# EAGLE schematic PinHeck Test Jig (EAGLE 6.6.0)
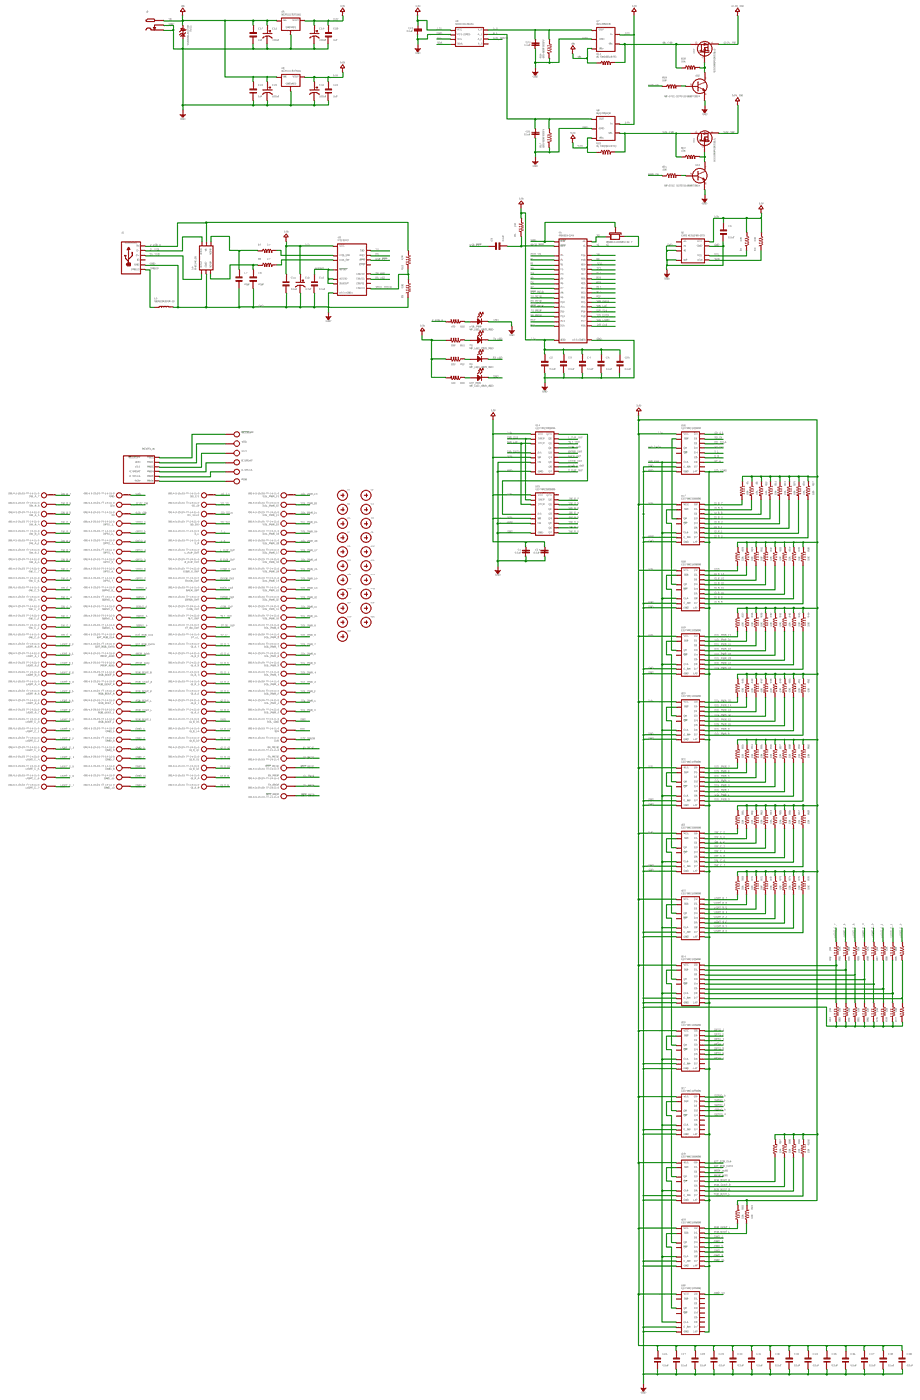
[diagram p0: schematic, sheet 1, overview]
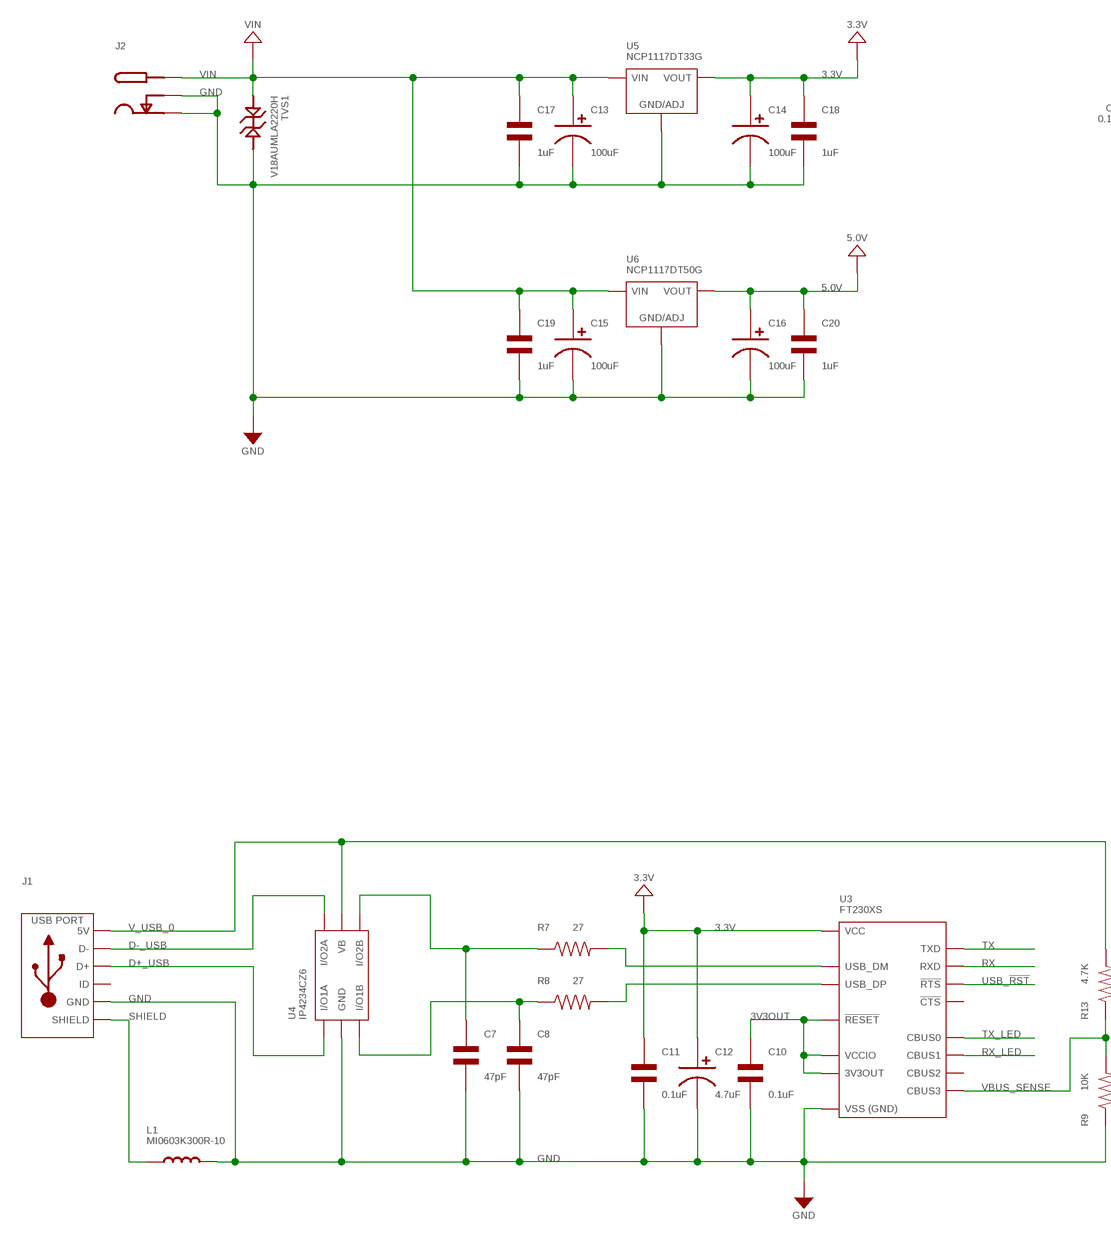
[diagram p1: schematic, sheet 1, part 1 of 7]
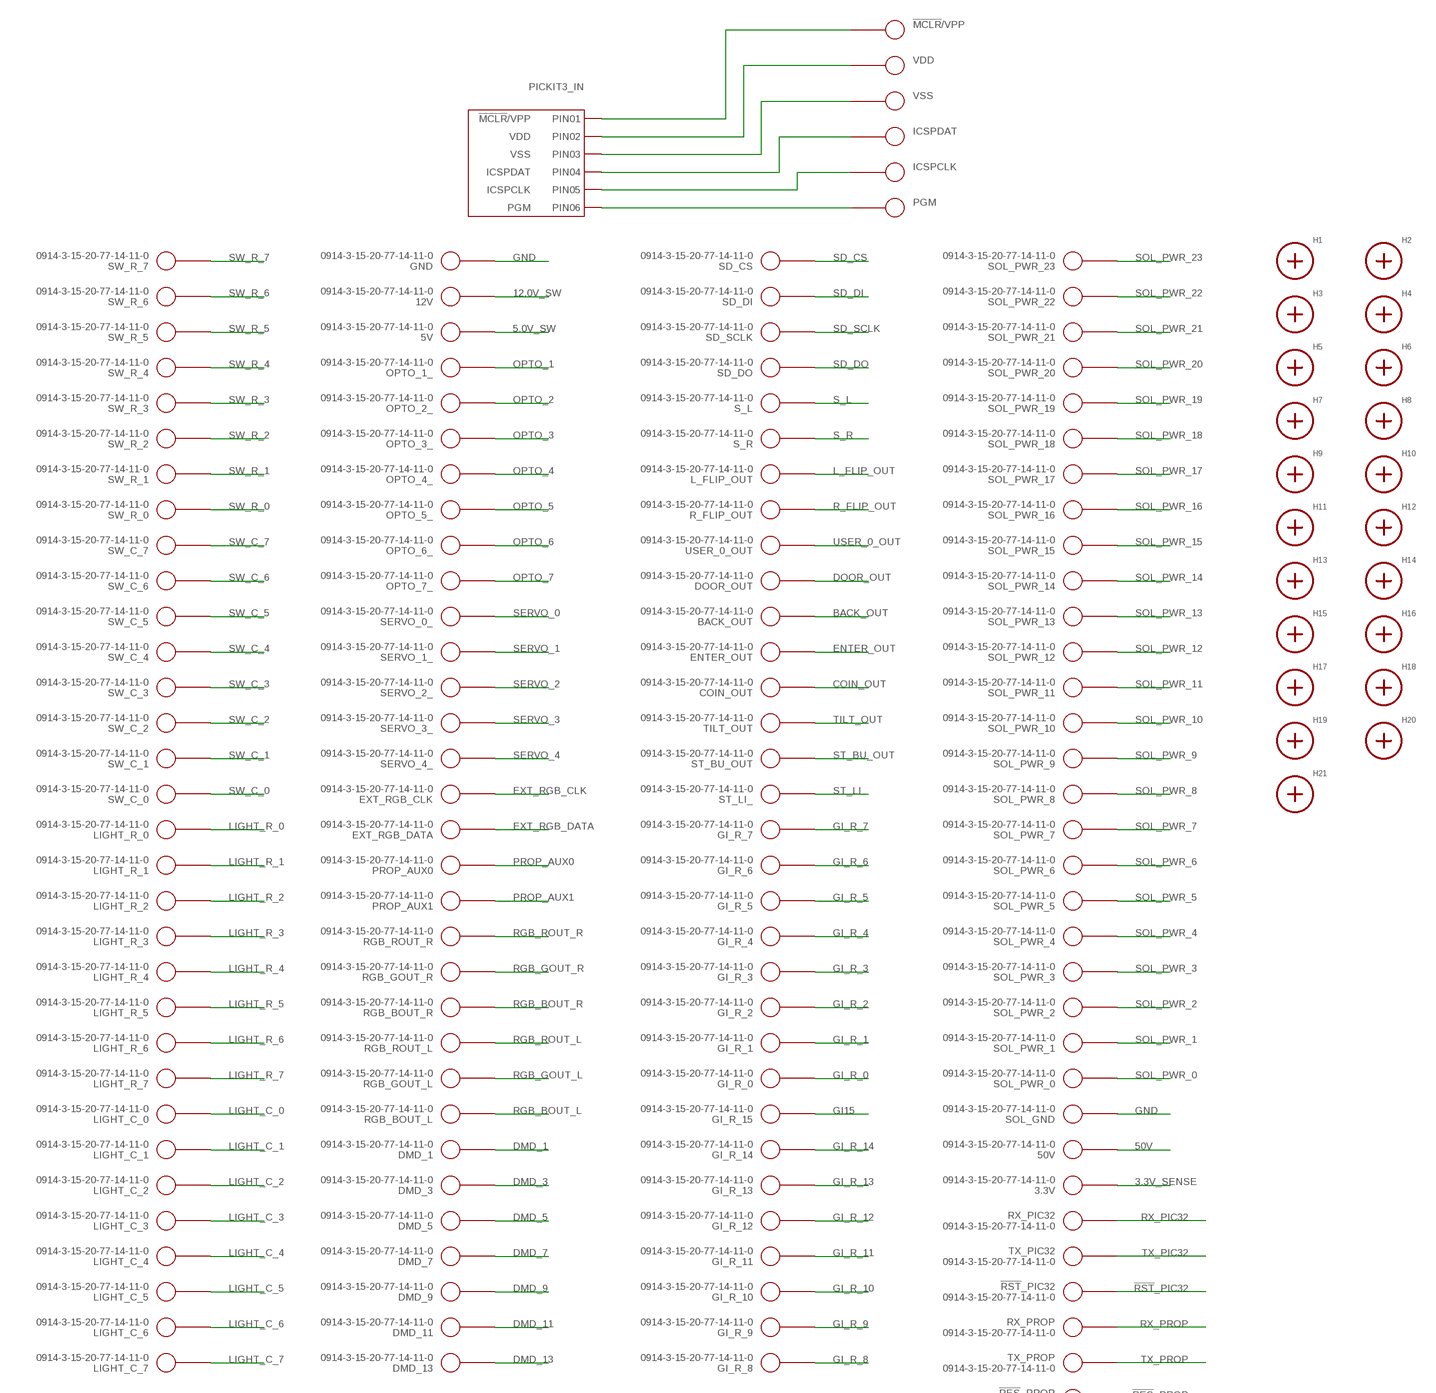
[diagram p2: schematic, sheet 1, part 2 of 7]
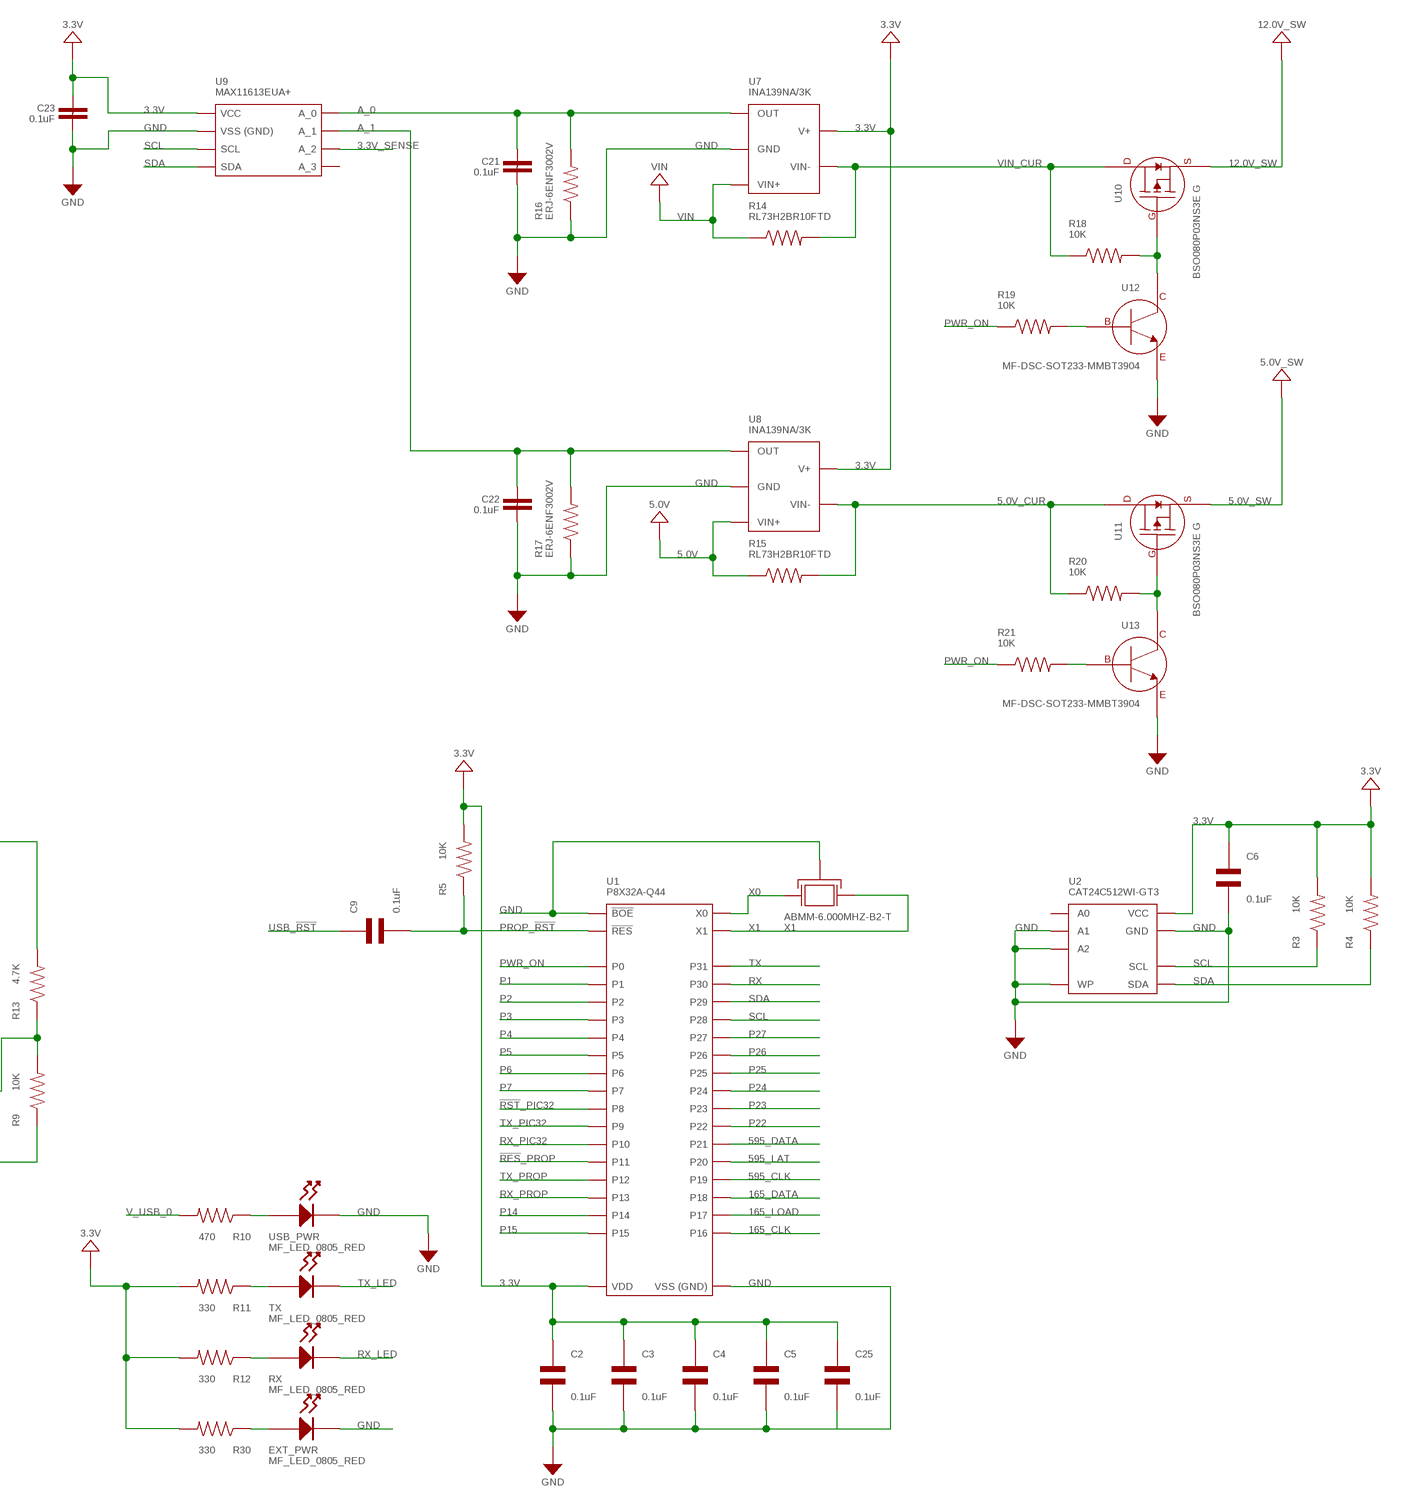
[diagram p3: schematic, sheet 1, part 3 of 7]
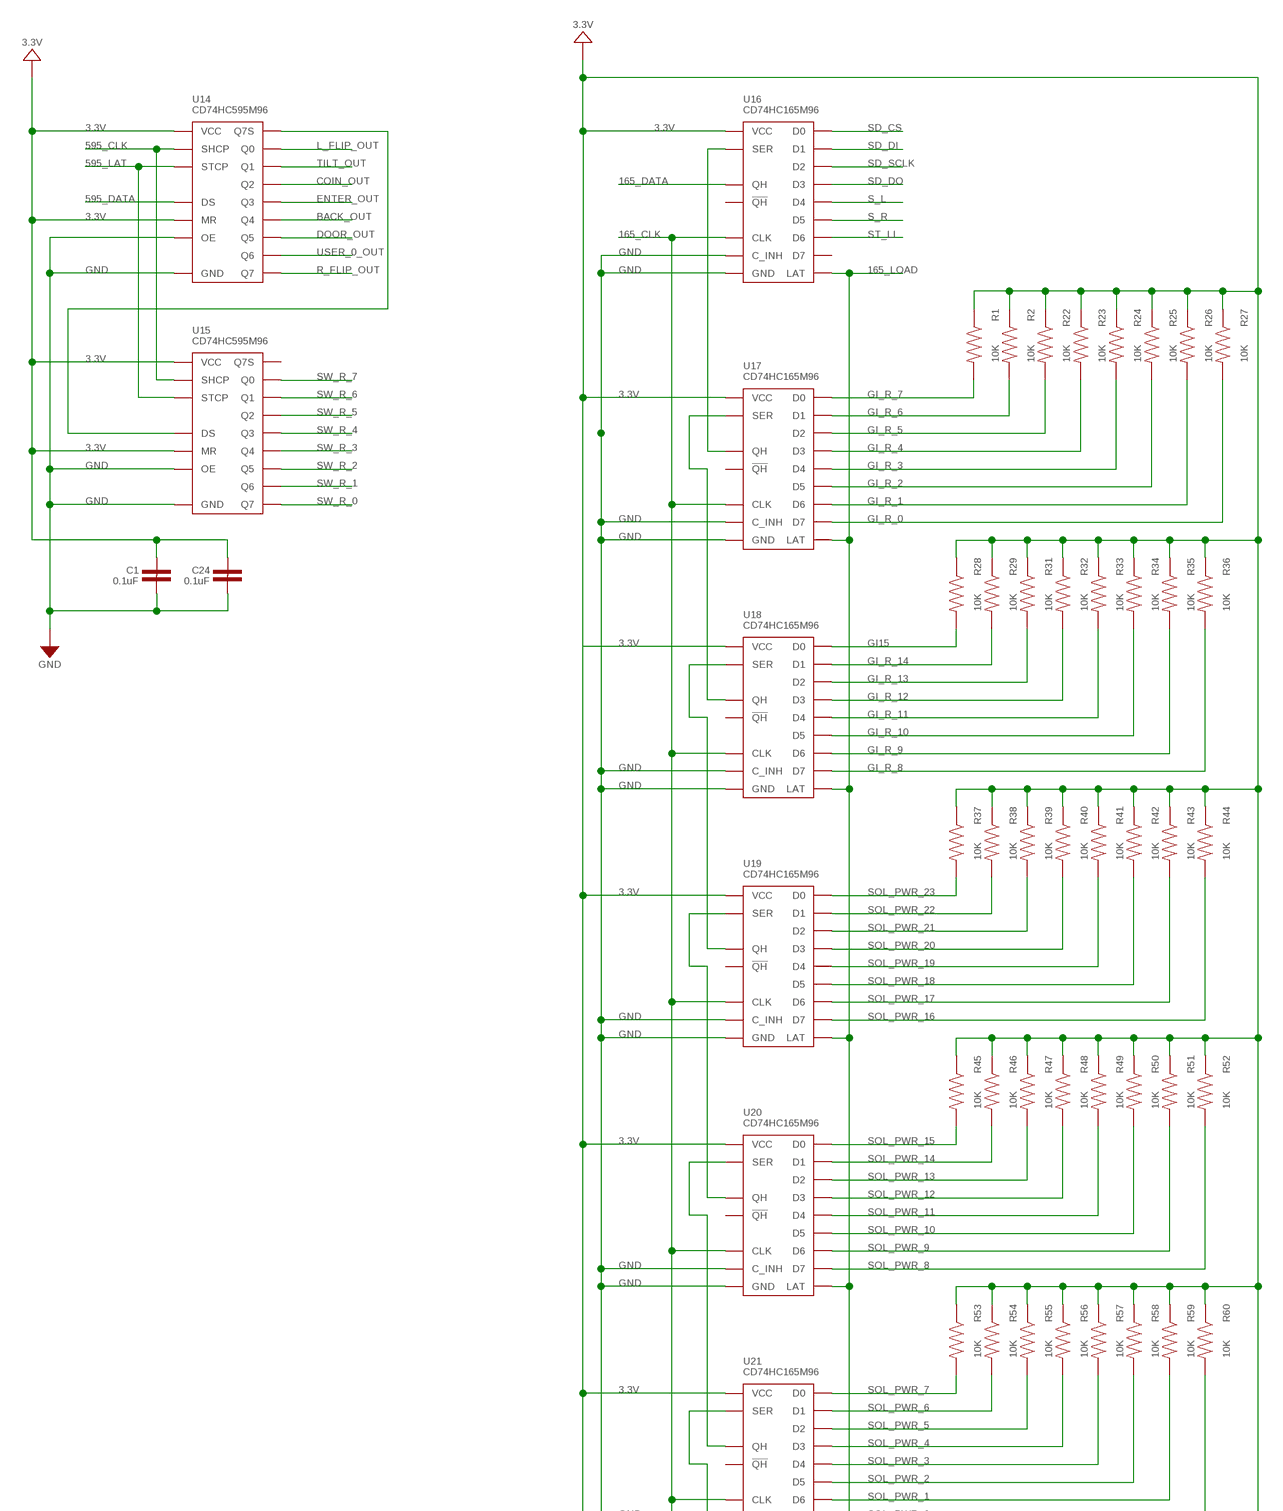
[diagram p4: schematic, sheet 1, part 4 of 7]
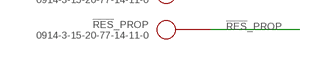
[diagram p5: schematic, sheet 1, part 5 of 7]
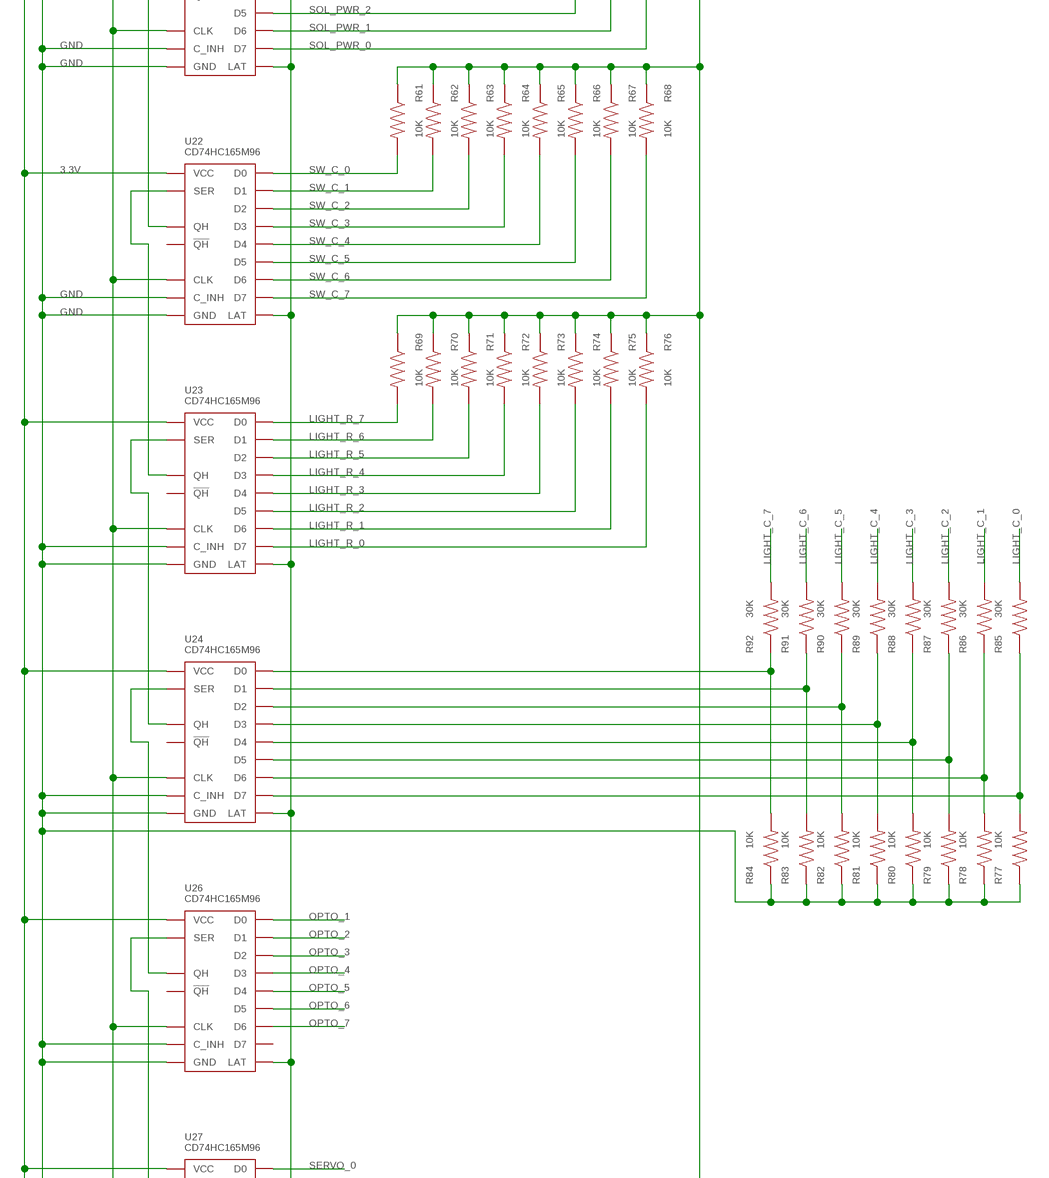
[diagram p6: schematic, sheet 1, part 6 of 7]
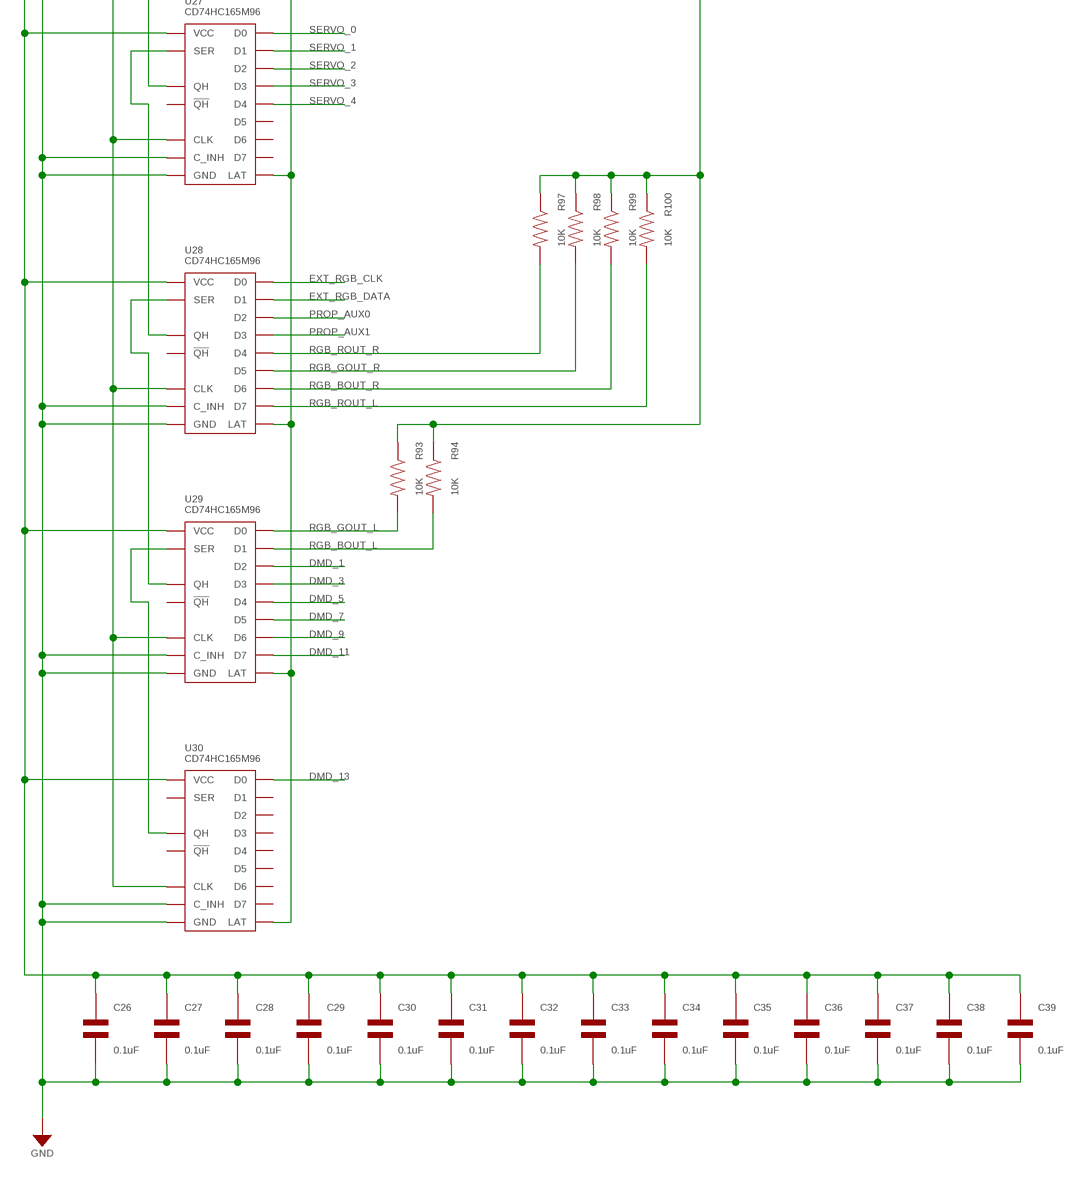
[diagram p7: schematic, sheet 1, part 7 of 7]

## Parts
3.3V  0914-3-15-20-77-14-11-0  POGO_PIN_0914-3-15-20-77-14-11-0  [0914-3-15-20-77-14-11-0]
5V  0914-3-15-20-77-14-11-0  POGO_PIN_0914-3-15-20-77-14-11-0  [0914-3-15-20-77-14-11-0]
12V  0914-3-15-20-77-14-11-0  POGO_PIN_0914-3-15-20-77-14-11-0  [0914-3-15-20-77-14-11-0]
50V  0914-3-15-20-77-14-11-0  POGO_PIN_0914-3-15-20-77-14-11-0  [0914-3-15-20-77-14-11-0]
!MCLR!/VPP  POGO_PIN_0914-3-15-20-77-14-11-0  [0914-3-15-20-77-14-11-0]
!RES!_PROP  0914-3-15-20-77-14-11-0  POGO_PIN_0914-3-15-20-77-14-11-0  [0914-3-15-20-77-14-11-0]
!RST!_PIC32  0914-3-15-20-77-14-11-0  POGO_PIN_0914-3-15-20-77-14-11-0  [0914-3-15-20-77-14-11-0]
BACK_OUT  0914-3-15-20-77-14-11-0  POGO_PIN_0914-3-15-20-77-14-11-0  [0914-3-15-20-77-14-11-0]
C1  0.1uF  CAPACITOR_NON_POLAR_0805  [0805]
C2  0.1uF  CAPACITOR_NP_0603  [C0603]
C3  0.1uF  CAPACITOR_NP_0603  [C0603]
C4  0.1uF  CAPACITOR_NP_0603  [C0603]
C5  0.1uF  CAPACITOR_NP_0603  [C0603]
C6  0.1uF  CAPACITOR_NP_0603  [C0603]
C7  47pF  CAPACITOR_NP_0603  [C0603]
C8  47pF  CAPACITOR_NP_0603  [C0603]
C9  0.1uF  CAPACITOR_NP_0603  [C0603]
C10  0.1uF  CAPACITOR_NP_0603  [C0603]
C11  0.1uF  CAPACITOR_NP_0603  [C0603]
C12  4.7uF  CAPACITOR_P_4MM  [CP4MM]
C13  100uF  CAPACITOR_P_6.3MM  [CP6.3MM]
C14  100uF  CAPACITOR_P_6.3MM  [CP6.3MM]
C15  100uF  CAPACITOR_P_6.3MM  [CP6.3MM]
C16  100uF  CAPACITOR_P_6.3MM  [CP6.3MM]
C17  1uF  CAPACITOR_NP_0805  [C0805]
C18  1uF  CAPACITOR_NP_0805  [C0805]
C19  1uF  CAPACITOR_NP_0805  [C0805]
C20  1uF  CAPACITOR_NP_0805  [C0805]
C21  0.1uF  CAPACITOR_NON_POLAR_0805  [0805]
C22  0.1uF  CAPACITOR_NON_POLAR_0805  [0805]
C23  0.1uF  CAPACITOR_NON_POLAR_0805  [0805]
C24  0.1uF  CAPACITOR_NON_POLAR_0805  [0805]
C25  0.1uF  CAPACITOR_NP_0603  [C0603]
C26  0.1uF  CAPACITOR_NP_0603  [C0603]
C27  0.1uF  CAPACITOR_NP_0603  [C0603]
C28  0.1uF  CAPACITOR_NP_0603  [C0603]
C29  0.1uF  CAPACITOR_NP_0603  [C0603]
C30  0.1uF  CAPACITOR_NP_0603  [C0603]
C31  0.1uF  CAPACITOR_NP_0603  [C0603]
C32  0.1uF  CAPACITOR_NP_0603  [C0603]
C33  0.1uF  CAPACITOR_NP_0603  [C0603]
C34  0.1uF  CAPACITOR_NP_0603  [C0603]
C35  0.1uF  CAPACITOR_NP_0603  [C0603]
C36  0.1uF  CAPACITOR_NP_0603  [C0603]
C37  0.1uF  CAPACITOR_NP_0603  [C0603]
C38  0.1uF  CAPACITOR_NP_0603  [C0603]
C39  0.1uF  CAPACITOR_NP_0603  [C0603]
COIN_OUT  0914-3-15-20-77-14-11-0  POGO_PIN_0914-3-15-20-77-14-11-0  [0914-3-15-20-77-14-11-0]
DMD_1  0914-3-15-20-77-14-11-0  POGO_PIN_0914-3-15-20-77-14-11-0  [0914-3-15-20-77-14-11-0]
DMD_3  0914-3-15-20-77-14-11-0  POGO_PIN_0914-3-15-20-77-14-11-0  [0914-3-15-20-77-14-11-0]
DMD_5  0914-3-15-20-77-14-11-0  POGO_PIN_0914-3-15-20-77-14-11-0  [0914-3-15-20-77-14-11-0]
DMD_7  0914-3-15-20-77-14-11-0  POGO_PIN_0914-3-15-20-77-14-11-0  [0914-3-15-20-77-14-11-0]
DMD_9  0914-3-15-20-77-14-11-0  POGO_PIN_0914-3-15-20-77-14-11-0  [0914-3-15-20-77-14-11-0]
DMD_11  0914-3-15-20-77-14-11-0  POGO_PIN_0914-3-15-20-77-14-11-0  [0914-3-15-20-77-14-11-0]
DMD_13  0914-3-15-20-77-14-11-0  POGO_PIN_0914-3-15-20-77-14-11-0  [0914-3-15-20-77-14-11-0]
DOOR_OUT  0914-3-15-20-77-14-11-0  POGO_PIN_0914-3-15-20-77-14-11-0  [0914-3-15-20-77-14-11-0]
ENTER_OUT  0914-3-15-20-77-14-11-0  POGO_PIN_0914-3-15-20-77-14-11-0  [0914-3-15-20-77-14-11-0]
EXT_PWR  MF_LED_0805_RED  LED_SINGLE_0805  [LED0805]
EXT_RGB_CLK  0914-3-15-20-77-14-11-0  POGO_PIN_0914-3-15-20-77-14-11-0  [0914-3-15-20-77-14-11-0]
EXT_RGB_DATA  0914-3-15-20-77-14-11-0  POGO_PIN_0914-3-15-20-77-14-11-0  [0914-3-15-20-77-14-11-0]
GI_R_0  0914-3-15-20-77-14-11-0  POGO_PIN_0914-3-15-20-77-14-11-0  [0914-3-15-20-77-14-11-0]
GI_R_1  0914-3-15-20-77-14-11-0  POGO_PIN_0914-3-15-20-77-14-11-0  [0914-3-15-20-77-14-11-0]
GI_R_2  0914-3-15-20-77-14-11-0  POGO_PIN_0914-3-15-20-77-14-11-0  [0914-3-15-20-77-14-11-0]
GI_R_3  0914-3-15-20-77-14-11-0  POGO_PIN_0914-3-15-20-77-14-11-0  [0914-3-15-20-77-14-11-0]
GI_R_4  0914-3-15-20-77-14-11-0  POGO_PIN_0914-3-15-20-77-14-11-0  [0914-3-15-20-77-14-11-0]
GI_R_5  0914-3-15-20-77-14-11-0  POGO_PIN_0914-3-15-20-77-14-11-0  [0914-3-15-20-77-14-11-0]
GI_R_6  0914-3-15-20-77-14-11-0  POGO_PIN_0914-3-15-20-77-14-11-0  [0914-3-15-20-77-14-11-0]
GI_R_7  0914-3-15-20-77-14-11-0  POGO_PIN_0914-3-15-20-77-14-11-0  [0914-3-15-20-77-14-11-0]
GI_R_8  0914-3-15-20-77-14-11-0  POGO_PIN_0914-3-15-20-77-14-11-0  [0914-3-15-20-77-14-11-0]
GI_R_9  0914-3-15-20-77-14-11-0  POGO_PIN_0914-3-15-20-77-14-11-0  [0914-3-15-20-77-14-11-0]
GI_R_10  0914-3-15-20-77-14-11-0  POGO_PIN_0914-3-15-20-77-14-11-0  [0914-3-15-20-77-14-11-0]
GI_R_11  0914-3-15-20-77-14-11-0  POGO_PIN_0914-3-15-20-77-14-11-0  [0914-3-15-20-77-14-11-0]
GI_R_12  0914-3-15-20-77-14-11-0  POGO_PIN_0914-3-15-20-77-14-11-0  [0914-3-15-20-77-14-11-0]
GI_R_13  0914-3-15-20-77-14-11-0  POGO_PIN_0914-3-15-20-77-14-11-0  [0914-3-15-20-77-14-11-0]
GI_R_14  0914-3-15-20-77-14-11-0  POGO_PIN_0914-3-15-20-77-14-11-0  [0914-3-15-20-77-14-11-0]
GI_R_15  0914-3-15-20-77-14-11-0  POGO_PIN_0914-3-15-20-77-14-11-0  [0914-3-15-20-77-14-11-0]
GND  0914-3-15-20-77-14-11-0  POGO_PIN_0914-3-15-20-77-14-11-0  [0914-3-15-20-77-14-11-0]
H1  2263-2  MOUNT_HOLE120MIL  [MOUNT_HOLE_120MIL]
H2  2263-2  MOUNT_HOLE120MIL  [MOUNT_HOLE_120MIL]
H3  2263-2  MOUNT_HOLE120MIL  [MOUNT_HOLE_120MIL]
H4  2263-2  MOUNT_HOLE120MIL  [MOUNT_HOLE_120MIL]
H5  2263-2  MOUNT_HOLE120MIL  [MOUNT_HOLE_120MIL]
H6  2263-2  MOUNT_HOLE120MIL  [MOUNT_HOLE_120MIL]
H7  2263-2  MOUNT_HOLE120MIL  [MOUNT_HOLE_120MIL]
H8  2263-2  MOUNT_HOLE120MIL  [MOUNT_HOLE_120MIL]
H9  2263-2  MOUNT_HOLE120MIL  [MOUNT_HOLE_120MIL]
H10  2263-2  MOUNT_HOLE120MIL  [MOUNT_HOLE_120MIL]
H11  2263-2  MOUNT_HOLE120MIL  [MOUNT_HOLE_120MIL]
H12  2263-2  MOUNT_HOLE120MIL  [MOUNT_HOLE_120MIL]
H13  2263-2  MOUNT_HOLE120MIL  [MOUNT_HOLE_120MIL]
H14  2263-2  MOUNT_HOLE120MIL  [MOUNT_HOLE_120MIL]
H15  2263-2  MOUNT_HOLE120MIL  [MOUNT_HOLE_120MIL]
H16  2263-2  MOUNT_HOLE120MIL  [MOUNT_HOLE_120MIL]
H17  2263-2  MOUNT_HOLE120MIL  [MOUNT_HOLE_120MIL]
H18  2263-2  MOUNT_HOLE120MIL  [MOUNT_HOLE_120MIL]
H19  2263-2  MOUNT_HOLE120MIL  [MOUNT_HOLE_120MIL]
H20  2263-2  MOUNT_HOLE120MIL  [MOUNT_HOLE_120MIL]
H21  2263-2  MOUNT_HOLE120MIL  [MOUNT_HOLE_120MIL]
ICSPCLK  POGO_PIN_0914-3-15-20-77-14-11-0  [0914-3-15-20-77-14-11-0]
ICSPDAT  POGO_PIN_0914-3-15-20-77-14-11-0  [0914-3-15-20-77-14-11-0]
J1  USB_MICRO_RIGHT  [MICROUSB-RIGHT]
J2  DC_PWR_JACK_2.5MM_RIGHT  [DC_PWR_JACK]
L1  MI0603K300R-10  INDUCTOR_0603  [L0603]
L_FLIP_OUT  0914-3-15-20-77-14-11-0  POGO_PIN_0914-3-15-20-77-14-11-0  [0914-3-15-20-77-14-11-0]
LIGHT_C_0  0914-3-15-20-77-14-11-0  POGO_PIN_0914-3-15-20-77-14-11-0  [0914-3-15-20-77-14-11-0]
LIGHT_C_1  0914-3-15-20-77-14-11-0  POGO_PIN_0914-3-15-20-77-14-11-0  [0914-3-15-20-77-14-11-0]
LIGHT_C_2  0914-3-15-20-77-14-11-0  POGO_PIN_0914-3-15-20-77-14-11-0  [0914-3-15-20-77-14-11-0]
LIGHT_C_3  0914-3-15-20-77-14-11-0  POGO_PIN_0914-3-15-20-77-14-11-0  [0914-3-15-20-77-14-11-0]
LIGHT_C_4  0914-3-15-20-77-14-11-0  POGO_PIN_0914-3-15-20-77-14-11-0  [0914-3-15-20-77-14-11-0]
LIGHT_C_5  0914-3-15-20-77-14-11-0  POGO_PIN_0914-3-15-20-77-14-11-0  [0914-3-15-20-77-14-11-0]
LIGHT_C_6  0914-3-15-20-77-14-11-0  POGO_PIN_0914-3-15-20-77-14-11-0  [0914-3-15-20-77-14-11-0]
LIGHT_C_7  0914-3-15-20-77-14-11-0  POGO_PIN_0914-3-15-20-77-14-11-0  [0914-3-15-20-77-14-11-0]
LIGHT_R_0  0914-3-15-20-77-14-11-0  POGO_PIN_0914-3-15-20-77-14-11-0  [0914-3-15-20-77-14-11-0]
LIGHT_R_1  0914-3-15-20-77-14-11-0  POGO_PIN_0914-3-15-20-77-14-11-0  [0914-3-15-20-77-14-11-0]
LIGHT_R_2  0914-3-15-20-77-14-11-0  POGO_PIN_0914-3-15-20-77-14-11-0  [0914-3-15-20-77-14-11-0]
LIGHT_R_3  0914-3-15-20-77-14-11-0  POGO_PIN_0914-3-15-20-77-14-11-0  [0914-3-15-20-77-14-11-0]
LIGHT_R_4  0914-3-15-20-77-14-11-0  POGO_PIN_0914-3-15-20-77-14-11-0  [0914-3-15-20-77-14-11-0]
LIGHT_R_5  0914-3-15-20-77-14-11-0  POGO_PIN_0914-3-15-20-77-14-11-0  [0914-3-15-20-77-14-11-0]
LIGHT_R_6  0914-3-15-20-77-14-11-0  POGO_PIN_0914-3-15-20-77-14-11-0  [0914-3-15-20-77-14-11-0]
LIGHT_R_7  0914-3-15-20-77-14-11-0  POGO_PIN_0914-3-15-20-77-14-11-0  [0914-3-15-20-77-14-11-0]
OPTO_1_  0914-3-15-20-77-14-11-0  POGO_PIN_0914-3-15-20-77-14-11-0  [0914-3-15-20-77-14-11-0]
OPTO_2_  0914-3-15-20-77-14-11-0  POGO_PIN_0914-3-15-20-77-14-11-0  [0914-3-15-20-77-14-11-0]
OPTO_3_  0914-3-15-20-77-14-11-0  POGO_PIN_0914-3-15-20-77-14-11-0  [0914-3-15-20-77-14-11-0]
OPTO_4_  0914-3-15-20-77-14-11-0  POGO_PIN_0914-3-15-20-77-14-11-0  [0914-3-15-20-77-14-11-0]
OPTO_5_  0914-3-15-20-77-14-11-0  POGO_PIN_0914-3-15-20-77-14-11-0  [0914-3-15-20-77-14-11-0]
OPTO_6_  0914-3-15-20-77-14-11-0  POGO_PIN_0914-3-15-20-77-14-11-0  [0914-3-15-20-77-14-11-0]
OPTO_7_  0914-3-15-20-77-14-11-0  POGO_PIN_0914-3-15-20-77-14-11-0  [0914-3-15-20-77-14-11-0]
PGM  POGO_PIN_0914-3-15-20-77-14-11-0  [0914-3-15-20-77-14-11-0]
PICKIT3_IN  CON_01X06_2.54MM_PIN_HEADER  [2.54MM_01X06_PIN_HEADER]
PROP_AUX0  0914-3-15-20-77-14-11-0  POGO_PIN_0914-3-15-20-77-14-11-0  [0914-3-15-20-77-14-11-0]
PROP_AUX1  0914-3-15-20-77-14-11-0  POGO_PIN_0914-3-15-20-77-14-11-0  [0914-3-15-20-77-14-11-0]
R1  10K  RESISTOR_0603  [R0603]
R2  10K  RESISTOR_0603  [R0603]
R3  10K  RESISTOR_0603  [R0603]
R4  10K  RESISTOR_0603  [R0603]
R5  10K  RESISTOR_0603  [R0603]
R7  27  RESISTOR_0603  [R0603]
R8  27  RESISTOR_0603  [R0603]
R9  10K  RESISTOR_0603  [R0603]
R10  470  RESISTOR_0603  [R0603]
R11  330  RESISTOR_0603  [R0603]
R12  330  RESISTOR_0603  [R0603]
R13  4.7K  RESISTOR_0603  [R0603]
R14  RL73H2BR10FTD  RESISTOR_1206  [1206]
R15  RL73H2BR10FTD  RESISTOR_1206  [1206]
R16  ERJ-6ENF3002V  RESISTOR_0805  [0805]
R17  ERJ-6ENF3002V  RESISTOR_0805  [0805]
R18  10K  RESISTOR_0805  [0805]
R19  10K  RESISTOR_0805  [0805]
R20  10K  RESISTOR_0805  [0805]
R21  10K  RESISTOR_0805  [0805]
R22  10K  RESISTOR_0603  [R0603]
R23  10K  RESISTOR_0603  [R0603]
R24  10K  RESISTOR_0603  [R0603]
R25  10K  RESISTOR_0603  [R0603]
R26  10K  RESISTOR_0603  [R0603]
R27  10K  RESISTOR_0603  [R0603]
R28  10K  RESISTOR_0603  [R0603]
R29  10K  RESISTOR_0603  [R0603]
R30  330  RESISTOR_0603  [R0603]
R31  10K  RESISTOR_0603  [R0603]
R32  10K  RESISTOR_0603  [R0603]
R33  10K  RESISTOR_0603  [R0603]
R34  10K  RESISTOR_0603  [R0603]
R35  10K  RESISTOR_0603  [R0603]
R36  10K  RESISTOR_0603  [R0603]
R37  10K  RESISTOR_0603  [R0603]
R38  10K  RESISTOR_0603  [R0603]
R39  10K  RESISTOR_0603  [R0603]
R40  10K  RESISTOR_0603  [R0603]
R41  10K  RESISTOR_0603  [R0603]
R42  10K  RESISTOR_0603  [R0603]
R43  10K  RESISTOR_0603  [R0603]
R44  10K  RESISTOR_0603  [R0603]
R45  10K  RESISTOR_0603  [R0603]
R46  10K  RESISTOR_0603  [R0603]
R47  10K  RESISTOR_0603  [R0603]
R48  10K  RESISTOR_0603  [R0603]
R49  10K  RESISTOR_0603  [R0603]
R50  10K  RESISTOR_0603  [R0603]
R51  10K  RESISTOR_0603  [R0603]
R52  10K  RESISTOR_0603  [R0603]
R53  10K  RESISTOR_0603  [R0603]
R54  10K  RESISTOR_0603  [R0603]
R55  10K  RESISTOR_0603  [R0603]
R56  10K  RESISTOR_0603  [R0603]
R57  10K  RESISTOR_0603  [R0603]
R58  10K  RESISTOR_0603  [R0603]
R59  10K  RESISTOR_0603  [R0603]
R60  10K  RESISTOR_0603  [R0603]
R61  10K  RESISTOR_0603  [R0603]
R62  10K  RESISTOR_0603  [R0603]
R63  10K  RESISTOR_0603  [R0603]
R64  10K  RESISTOR_0603  [R0603]
R65  10K  RESISTOR_0603  [R0603]
R66  10K  RESISTOR_0603  [R0603]
R67  10K  RESISTOR_0603  [R0603]
R68  10K  RESISTOR_0603  [R0603]
R69  10K  RESISTOR_0603  [R0603]
R70  10K  RESISTOR_0603  [R0603]
R71  10K  RESISTOR_0603  [R0603]
R72  10K  RESISTOR_0603  [R0603]
R73  10K  RESISTOR_0603  [R0603]
R74  10K  RESISTOR_0603  [R0603]
R75  10K  RESISTOR_0603  [R0603]
R76  10K  RESISTOR_0603  [R0603]
R77  10K  RESISTOR_0603  [R0603]
R78  10K  RESISTOR_0603  [R0603]
R79  10K  RESISTOR_0603  [R0603]
R80  10K  RESISTOR_0603  [R0603]
R81  10K  RESISTOR_0603  [R0603]
R82  10K  RESISTOR_0603  [R0603]
R83  10K  RESISTOR_0603  [R0603]
R84  10K  RESISTOR_0603  [R0603]
R85  30K  RESISTOR_0603  [R0603]
R86  30K  RESISTOR_0603  [R0603]
R87  30K  RESISTOR_0603  [R0603]
R88  30K  RESISTOR_0603  [R0603]
R89  30K  RESISTOR_0603  [R0603]
R90  30K  RESISTOR_0603  [R0603]
R91  30K  RESISTOR_0603  [R0603]
R92  30K  RESISTOR_0603  [R0603]
R93  10K  RESISTOR_0603  [R0603]
R94  10K  RESISTOR_0603  [R0603]
R97  10K  RESISTOR_0603  [R0603]
R98  10K  RESISTOR_0603  [R0603]
R99  10K  RESISTOR_0603  [R0603]
R100  10K  RESISTOR_0603  [R0603]
R_FLIP_OUT  0914-3-15-20-77-14-11-0  POGO_PIN_0914-3-15-20-77-14-11-0  [0914-3-15-20-77-14-11-0]
RGB_BOUT_L  0914-3-15-20-77-14-11-0  POGO_PIN_0914-3-15-20-77-14-11-0  [0914-3-15-20-77-14-11-0]
RGB_BOUT_R  0914-3-15-20-77-14-11-0  POGO_PIN_0914-3-15-20-77-14-11-0  [0914-3-15-20-77-14-11-0]
RGB_GOUT_L  0914-3-15-20-77-14-11-0  POGO_PIN_0914-3-15-20-77-14-11-0  [0914-3-15-20-77-14-11-0]
RGB_GOUT_R  0914-3-15-20-77-14-11-0  POGO_PIN_0914-3-15-20-77-14-11-0  [0914-3-15-20-77-14-11-0]
RGB_ROUT_L  0914-3-15-20-77-14-11-0  POGO_PIN_0914-3-15-20-77-14-11-0  [0914-3-15-20-77-14-11-0]
RGB_ROUT_R  0914-3-15-20-77-14-11-0  POGO_PIN_0914-3-15-20-77-14-11-0  [0914-3-15-20-77-14-11-0]
RX  MF_LED_0805_RED  LED_SINGLE_0805  [LED0805]
RX_PIC32  0914-3-15-20-77-14-11-0  POGO_PIN_0914-3-15-20-77-14-11-0  [0914-3-15-20-77-14-11-0]
RX_PROP  0914-3-15-20-77-14-11-0  POGO_PIN_0914-3-15-20-77-14-11-0  [0914-3-15-20-77-14-11-0]
S_L  0914-3-15-20-77-14-11-0  POGO_PIN_0914-3-15-20-77-14-11-0  [0914-3-15-20-77-14-11-0]
S_R  0914-3-15-20-77-14-11-0  POGO_PIN_0914-3-15-20-77-14-11-0  [0914-3-15-20-77-14-11-0]
SD_CS  0914-3-15-20-77-14-11-0  POGO_PIN_0914-3-15-20-77-14-11-0  [0914-3-15-20-77-14-11-0]
SD_DI  0914-3-15-20-77-14-11-0  POGO_PIN_0914-3-15-20-77-14-11-0  [0914-3-15-20-77-14-11-0]
SD_DO  0914-3-15-20-77-14-11-0  POGO_PIN_0914-3-15-20-77-14-11-0  [0914-3-15-20-77-14-11-0]
SD_SCLK  0914-3-15-20-77-14-11-0  POGO_PIN_0914-3-15-20-77-14-11-0  [0914-3-15-20-77-14-11-0]
SERVO_0_  0914-3-15-20-77-14-11-0  POGO_PIN_0914-3-15-20-77-14-11-0  [0914-3-15-20-77-14-11-0]
SERVO_1_  0914-3-15-20-77-14-11-0  POGO_PIN_0914-3-15-20-77-14-11-0  [0914-3-15-20-77-14-11-0]
SERVO_2_  0914-3-15-20-77-14-11-0  POGO_PIN_0914-3-15-20-77-14-11-0  [0914-3-15-20-77-14-11-0]
SERVO_3_  0914-3-15-20-77-14-11-0  POGO_PIN_0914-3-15-20-77-14-11-0  [0914-3-15-20-77-14-11-0]
SERVO_4_  0914-3-15-20-77-14-11-0  POGO_PIN_0914-3-15-20-77-14-11-0  [0914-3-15-20-77-14-11-0]
SOL_GND  0914-3-15-20-77-14-11-0  POGO_PIN_0914-3-15-20-77-14-11-0  [0914-3-15-20-77-14-11-0]
SOL_PWR_0  0914-3-15-20-77-14-11-0  POGO_PIN_0914-3-15-20-77-14-11-0  [0914-3-15-20-77-14-11-0]
SOL_PWR_1  0914-3-15-20-77-14-11-0  POGO_PIN_0914-3-15-20-77-14-11-0  [0914-3-15-20-77-14-11-0]
SOL_PWR_2  0914-3-15-20-77-14-11-0  POGO_PIN_0914-3-15-20-77-14-11-0  [0914-3-15-20-77-14-11-0]
SOL_PWR_3  0914-3-15-20-77-14-11-0  POGO_PIN_0914-3-15-20-77-14-11-0  [0914-3-15-20-77-14-11-0]
SOL_PWR_4  0914-3-15-20-77-14-11-0  POGO_PIN_0914-3-15-20-77-14-11-0  [0914-3-15-20-77-14-11-0]
SOL_PWR_5  0914-3-15-20-77-14-11-0  POGO_PIN_0914-3-15-20-77-14-11-0  [0914-3-15-20-77-14-11-0]
SOL_PWR_6  0914-3-15-20-77-14-11-0  POGO_PIN_0914-3-15-20-77-14-11-0  [0914-3-15-20-77-14-11-0]
SOL_PWR_7  0914-3-15-20-77-14-11-0  POGO_PIN_0914-3-15-20-77-14-11-0  [0914-3-15-20-77-14-11-0]
SOL_PWR_8  0914-3-15-20-77-14-11-0  POGO_PIN_0914-3-15-20-77-14-11-0  [0914-3-15-20-77-14-11-0]
SOL_PWR_9  0914-3-15-20-77-14-11-0  POGO_PIN_0914-3-15-20-77-14-11-0  [0914-3-15-20-77-14-11-0]
SOL_PWR_10  0914-3-15-20-77-14-11-0  POGO_PIN_0914-3-15-20-77-14-11-0  [0914-3-15-20-77-14-11-0]
SOL_PWR_11  0914-3-15-20-77-14-11-0  POGO_PIN_0914-3-15-20-77-14-11-0  [0914-3-15-20-77-14-11-0]
SOL_PWR_12  0914-3-15-20-77-14-11-0  POGO_PIN_0914-3-15-20-77-14-11-0  [0914-3-15-20-77-14-11-0]
SOL_PWR_13  0914-3-15-20-77-14-11-0  POGO_PIN_0914-3-15-20-77-14-11-0  [0914-3-15-20-77-14-11-0]
SOL_PWR_14  0914-3-15-20-77-14-11-0  POGO_PIN_0914-3-15-20-77-14-11-0  [0914-3-15-20-77-14-11-0]
SOL_PWR_15  0914-3-15-20-77-14-11-0  POGO_PIN_0914-3-15-20-77-14-11-0  [0914-3-15-20-77-14-11-0]
SOL_PWR_16  0914-3-15-20-77-14-11-0  POGO_PIN_0914-3-15-20-77-14-11-0  [0914-3-15-20-77-14-11-0]
SOL_PWR_17  0914-3-15-20-77-14-11-0  POGO_PIN_0914-3-15-20-77-14-11-0  [0914-3-15-20-77-14-11-0]
SOL_PWR_18  0914-3-15-20-77-14-11-0  POGO_PIN_0914-3-15-20-77-14-11-0  [0914-3-15-20-77-14-11-0]
SOL_PWR_19  0914-3-15-20-77-14-11-0  POGO_PIN_0914-3-15-20-77-14-11-0  [0914-3-15-20-77-14-11-0]
SOL_PWR_20  0914-3-15-20-77-14-11-0  POGO_PIN_0914-3-15-20-77-14-11-0  [0914-3-15-20-77-14-11-0]
SOL_PWR_21  0914-3-15-20-77-14-11-0  POGO_PIN_0914-3-15-20-77-14-11-0  [0914-3-15-20-77-14-11-0]
SOL_PWR_22  0914-3-15-20-77-14-11-0  POGO_PIN_0914-3-15-20-77-14-11-0  [0914-3-15-20-77-14-11-0]
SOL_PWR_23  0914-3-15-20-77-14-11-0  POGO_PIN_0914-3-15-20-77-14-11-0  [0914-3-15-20-77-14-11-0]
ST_BU_OUT  0914-3-15-20-77-14-11-0  POGO_PIN_0914-3-15-20-77-14-11-0  [0914-3-15-20-77-14-11-0]
ST_LI_  0914-3-15-20-77-14-11-0  POGO_PIN_0914-3-15-20-77-14-11-0  [0914-3-15-20-77-14-11-0]
SW_C_0  0914-3-15-20-77-14-11-0  POGO_PIN_0914-3-15-20-77-14-11-0  [0914-3-15-20-77-14-11-0]
SW_C_1  0914-3-15-20-77-14-11-0  POGO_PIN_0914-3-15-20-77-14-11-0  [0914-3-15-20-77-14-11-0]
SW_C_2  0914-3-15-20-77-14-11-0  POGO_PIN_0914-3-15-20-77-14-11-0  [0914-3-15-20-77-14-11-0]
SW_C_3  0914-3-15-20-77-14-11-0  POGO_PIN_0914-3-15-20-77-14-11-0  [0914-3-15-20-77-14-11-0]
SW_C_4  0914-3-15-20-77-14-11-0  POGO_PIN_0914-3-15-20-77-14-11-0  [0914-3-15-20-77-14-11-0]
SW_C_5  0914-3-15-20-77-14-11-0  POGO_PIN_0914-3-15-20-77-14-11-0  [0914-3-15-20-77-14-11-0]
SW_C_6  0914-3-15-20-77-14-11-0  POGO_PIN_0914-3-15-20-77-14-11-0  [0914-3-15-20-77-14-11-0]
SW_C_7  0914-3-15-20-77-14-11-0  POGO_PIN_0914-3-15-20-77-14-11-0  [0914-3-15-20-77-14-11-0]
SW_R_0  0914-3-15-20-77-14-11-0  POGO_PIN_0914-3-15-20-77-14-11-0  [0914-3-15-20-77-14-11-0]
SW_R_1  0914-3-15-20-77-14-11-0  POGO_PIN_0914-3-15-20-77-14-11-0  [0914-3-15-20-77-14-11-0]
SW_R_2  0914-3-15-20-77-14-11-0  POGO_PIN_0914-3-15-20-77-14-11-0  [0914-3-15-20-77-14-11-0]
SW_R_3  0914-3-15-20-77-14-11-0  POGO_PIN_0914-3-15-20-77-14-11-0  [0914-3-15-20-77-14-11-0]
SW_R_4  0914-3-15-20-77-14-11-0  POGO_PIN_0914-3-15-20-77-14-11-0  [0914-3-15-20-77-14-11-0]
SW_R_5  0914-3-15-20-77-14-11-0  POGO_PIN_0914-3-15-20-77-14-11-0  [0914-3-15-20-77-14-11-0]
SW_R_6  0914-3-15-20-77-14-11-0  POGO_PIN_0914-3-15-20-77-14-11-0  [0914-3-15-20-77-14-11-0]
SW_R_7  0914-3-15-20-77-14-11-0  POGO_PIN_0914-3-15-20-77-14-11-0  [0914-3-15-20-77-14-11-0]
TILT_OUT  0914-3-15-20-77-14-11-0  POGO_PIN_0914-3-15-20-77-14-11-0  [0914-3-15-20-77-14-11-0]
TVS1  V18AUMLA2220H  TVS_DIODE_2220  [2220]
TX  MF_LED_0805_RED  LED_SINGLE_0805  [LED0805]
TX_PIC32  0914-3-15-20-77-14-11-0  POGO_PIN_0914-3-15-20-77-14-11-0  [0914-3-15-20-77-14-11-0]
TX_PROP  0914-3-15-20-77-14-11-0  POGO_PIN_0914-3-15-20-77-14-11-0  [0914-3-15-20-77-14-11-0]
U1  P8X32A-Q44  [LQFP44]
U2  CAT24C512WI-GT3  EEPROM_I2CSOIC-8_W  [SOIC-8_W]
U3  FT230XS  [SSOP16]
U4  IP4234CZ6  [IP4234CZ6_SOT-457-6]
U5  NCP1117DT33G  LINEAR_VOTLAGE_REGULATORS_NCP1117DT  [NCP1117DT_DPAK-3]
U6  NCP1117DT50G  LINEAR_VOTLAGE_REGULATORS_NCP1117DT  [NCP1117DT_DPAK-3]
U7  INA139NA/3K  INA169SOT-23-5  [INA169NA/250_SOT-23-5]
U8  INA139NA/3K  INA169SOT-23-5  [INA169NA/250_SOT-23-5]
U9  MAX11613EUA+  [MAX11613_UMAX-8]
U10  BSO080P03NS3E G  MOSFET_P-CHANNEL_SINGLE_P3-POWER  [DSO-8]
U11  BSO080P03NS3E G  MOSFET_P-CHANNEL_SINGLE_P3-POWER  [DSO-8]
U12  MF-DSC-SOT233-MMBT3904  BJT_NPN_SINGLE_SOT-23  [SOT-23-3]
U13  MF-DSC-SOT233-MMBT3904  BJT_NPN_SINGLE_SOT-23  [SOT-23-3]
U14  CD74HC595M96  [CD74HC595_SOIC-16]
U15  CD74HC595M96  [CD74HC595_SOIC-16]
U16  CD74HC165M96  [CD74HC165_SOIC-16]
U17  CD74HC165M96  [CD74HC165_SOIC-16]
U18  CD74HC165M96  [CD74HC165_SOIC-16]
U19  CD74HC165M96  [CD74HC165_SOIC-16]
U20  CD74HC165M96  [CD74HC165_SOIC-16]
U21  CD74HC165M96  [CD74HC165_SOIC-16]
U22  CD74HC165M96  [CD74HC165_SOIC-16]
U23  CD74HC165M96  [CD74HC165_SOIC-16]
U24  CD74HC165M96  [CD74HC165_SOIC-16]
U26  CD74HC165M96  [CD74HC165_SOIC-16]
U27  CD74HC165M96  [CD74HC165_SOIC-16]
U28  CD74HC165M96  [CD74HC165_SOIC-16]
U29  CD74HC165M96  [CD74HC165_SOIC-16]
U30  CD74HC165M96  [CD74HC165_SOIC-16]
USB_PWR  MF_LED_0805_RED  LED_SINGLE_0805  [LED0805]
USER_0_OUT  0914-3-15-20-77-14-11-0  POGO_PIN_0914-3-15-20-77-14-11-0  [0914-3-15-20-77-14-11-0]
VDD  POGO_PIN_0914-3-15-20-77-14-11-0  [0914-3-15-20-77-14-11-0]
VSS  POGO_PIN_0914-3-15-20-77-14-11-0  [0914-3-15-20-77-14-11-0]
X1  ABMM-6.000MHZ-B2-T  XTL_7MMX5MM  [7MMX5MM]

## Nets
3.3V: C1.1 C2.P$1 C3.P$1 C4.P$1 C5.P$1 C6.P$1 C11.P$1 C12.P$1 C14.P$1 C18.P$1 C23.1 C24.1 C25.P$1 C26.P$1 C27.P$1 C28.P$1 C29.P$1 C30.P$1 C31.P$1 C32.P$1 C33.P$1 C34.P$1 C35.P$1 C36.P$1 C37.P$1 C38.P$1 C39.P$1 R1.P$1 R2.P$1 R3.P$2 R4.P$2 R5.P$2 R11.P$2 R12.P$2 R22.P$1 R23.P$1 R24.P$1 R25.P$1 R26.P$1 R27.P$1 R28.P$1 R29.P$1 R30.P$2 R31.P$1 R32.P$1 R33.P$1 R34.P$1 R35.P$1 R36.P$1 R37.P$1 R38.P$1 R39.P$1 R40.P$1 R41.P$1 R42.P$1 R43.P$1 R44.P$1 R45.P$1 R46.P$1 R47.P$1 R48.P$1 R49.P$1 R50.P$1 R51.P$1 R52.P$1 R53.P$1 R54.P$1 R55.P$1 R56.P$1 R57.P$1 R58.P$1 R59.P$1 R60.P$1 R61.P$1 R62.P$1 R63.P$1 R64.P$1 R65.P$1 R66.P$1 R67.P$1 R68.P$1 R69.P$1 R70.P$1 R71.P$1 R72.P$1 R73.P$1 R74.P$1 R75.P$1 R76.P$1 R93.P$1 R94.P$1 R97.P$1 R98.P$1 R99.P$1 R100.P$1 U1.8(VDD) U1.18(VDD) U1.30(VDD) U1.40(VDD) U2.8(VCC) U3.12(VCC) U5.TAB(OUT) U7.5(V+) U8.5(V+) U9.P$8(VCC) U14.10(MR) U14.16(VCC) U15.10(MR) U15.16(VCC) U16.16(VCC) U17.16(VCC) U18.16(VCC) U19.16(VCC) U20.16(VCC) U21.16(VCC) U22.16(VCC) U23.16(VCC) U24.16(VCC) U26.16(VCC) U27.16(VCC) U28.16(VCC) U29.16(VCC) U30.16(VCC)
3.3V_SENSE: 3.3V.P$1 U9.P$3(A_2)
3V3OUT: C10.P$1 U3.3(VCCIO) U3.10(3V3OUT) U3.11(!RESET)
5.0V: C16.P$1 C20.P$1 R15.1 U6.TAB(OUT) U8.3(VIN+)
5.0V_CUR: R15.2 R20.1 U8.4(VIN-) U11.5(DRAIN) U11.6(DRAIN) U11.7(DRAIN) U11.8(DRAIN)
5.0V_SW: 5V.P$1 U11.1(SOURCE) U11.2(SOURCE) U11.3(SOURCE)
12.0V_SW: 12V.P$1 U10.1(SOURCE) U10.2(SOURCE) U10.3(SOURCE)
50V: 50V.P$1
165_CLK: U1.19(P16) U16.2(CLK) U17.2(CLK) U18.2(CLK) U19.2(CLK) U20.2(CLK) U21.2(CLK) U22.2(CLK) U23.2(CLK) U24.2(CLK) U26.2(CLK) U27.2(CLK) U28.2(CLK) U29.2(CLK) U30.2(CLK)
165_DATA: U1.21(P18) U16.9(QH)
165_LOAD: U1.20(P17) U16.1(LAT) U17.1(LAT) U18.1(LAT) U19.1(LAT) U20.1(LAT) U21.1(LAT) U22.1(LAT) U23.1(LAT) U24.1(LAT) U26.1(LAT) U27.1(LAT) U28.1(LAT) U29.1(LAT) U30.1(LAT)
595_CLK: U1.22(P19) U14.11(SHCP) U15.11(SHCP)
595_DATA: U1.24(P21) U14.14(DS)
595_LAT: U1.23(P20) U14.12(STCP) U15.12(STCP)
!RES!_PROP: !RES!_PROP.P$1 U1.12(P11)
!RST!_PIC32: !RST!_PIC32.P$1 U1.9(P8)
A_0: C21.1 R16.2 U7.1(OUT) U9.P$1(A_0)
A_1: C22.1 R17.2 U8.1(OUT) U9.P$2(A_1)
BACK_OUT: BACK_OUT.P$1 U14.4(Q4)
COIN_OUT: COIN_OUT.P$1 U14.2(Q2)
D+_USB: J1.3(D+) U4.1(I/O1A)
D-_USB: J1.2(D-) U4.6(I/O2A)
DMD_1: DMD_1.P$1 U29.13(D2)
DMD_3: DMD_3.P$1 U29.14(D3)
DMD_5: DMD_5.P$1 U29.3(D4)
DMD_7: DMD_7.P$1 U29.4(D5)
DMD_9: DMD_9.P$1 U29.5(D6)
DMD_11: DMD_11.P$1 U29.6(D7)
DMD_13: DMD_13.P$1 U30.11(D0)
DOOR_OUT: DOOR_OUT.P$1 U14.5(Q5)
ENTER_OUT: ENTER_OUT.P$1 U14.3(Q3)
EXT_RGB_CLK: EXT_RGB_CLK.P$1 U28.11(D0)
EXT_RGB_DATA: EXT_RGB_DATA.P$1 U28.12(D1)
GI15: GI_R_15.P$1 R28.P$2 U18.11(D0)
GI_R_0: GI_R_0.P$1 R27.P$2 U17.6(D7)
GI_R_1: GI_R_1.P$1 R26.P$2 U17.5(D6)
GI_R_2: GI_R_2.P$1 R25.P$2 U17.4(D5)
GI_R_3: GI_R_3.P$1 R24.P$2 U17.3(D4)
GI_R_4: GI_R_4.P$1 R23.P$2 U17.14(D3)
GI_R_5: GI_R_5.P$1 R22.P$2 U17.13(D2)
GI_R_6: GI_R_6.P$1 R2.P$2 U17.12(D1)
GI_R_7: GI_R_7.P$1 R1.P$2 U17.11(D0)
GI_R_8: GI_R_8.P$1 R36.P$2 U18.6(D7)
GI_R_9: GI_R_9.P$1 R35.P$2 U18.5(D6)
GI_R_10: GI_R_10.P$1 R34.P$2 U18.4(D5)
GI_R_11: GI_R_11.P$1 R33.P$2 U18.3(D4)
GI_R_12: GI_R_12.P$1 R32.P$2 U18.14(D3)
GI_R_13: GI_R_13.P$1 R31.P$2 U18.13(D2)
GI_R_14: GI_R_14.P$1 R29.P$2 U18.12(D1)
GND: C1.2 C2.P$2 C3.P$2 C4.P$2 C5.P$2 C6.P$2 C7.P$2 C8.P$2 C10.P$2 C11.P$2 C12.P$2 C13.P$2 C14.P$2 C15.P$2 C16.P$2 C17.P$2 C18.P$2 C19.P$2 C20.P$2 C21.2 C22.2 C23.2 C24.2 C25.P$2 C26.P$2 C27.P$2 C28.P$2 C29.P$2 C30.P$2 C31.P$2 C32.P$2 C33.P$2 C34.P$2 C35.P$2 C36.P$2 C37.P$2 C38.P$2 C39.P$2 EXT_PWR.CATHODE GND.P$1 J1.5(GND) J2.SLEEVE1(SLEEVE) J2.SLEEVE2(SLEEVE_SHUNT) L1.P$2 R9.P$1 R16.1 R17.1 R77.P$1 R78.P$1 R79.P$1 R80.P$1 R81.P$1 R82.P$1 R83.P$1 R84.P$1 SOL_GND.P$1 TVS1.P$2 U1.5(VSS) U1.6(BOE') U1.17(VSS) U1.27(VSS) U1.39(VSS) U2.2(A1) U2.3(A2) U2.4(GND) U2.7(WP) U3.5(GND) U3.13(GND) U4.2(GND) U5.1(GND) U6.1(GND) U7.2(GND) U8.2(GND) U9.P$7(GND) U12.2(EMITTER) U13.2(EMITTER) U14.8(GND) U14.13(OE) U15.8(GND) U15.13(OE) U16.8(GND) U16.15(C_INH) U17.8(GND) U17.15(C_INH) U18.8(GND) U18.15(C_INH) U19.8(GND) U19.15(C_INH) U20.8(GND) U20.15(C_INH) U21.8(GND) U21.15(C_INH) U22.8(GND) U22.15(C_INH) U23.8(GND) U23.15(C_INH) U24.8(GND) U24.15(C_INH) U26.8(GND) U26.15(C_INH) U27.8(GND) U27.15(C_INH) U28.8(GND) U28.15(C_INH) U29.8(GND) U29.15(C_INH) U30.8(GND) U30.15(C_INH) USB_PWR.CATHODE X1.P$2(GND) X1.P$4(GND)
L_FLIP_OUT: L_FLIP_OUT.P$1 U14.15(Q0)
LIGHT_C_0: LIGHT_C_0.P$1 R85.P$2
LIGHT_C_1: LIGHT_C_1.P$1 R86.P$2
LIGHT_C_2: LIGHT_C_2.P$1 R87.P$2
LIGHT_C_3: LIGHT_C_3.P$1 R88.P$2
LIGHT_C_4: LIGHT_C_4.P$1 R89.P$2
LIGHT_C_5: LIGHT_C_5.P$1 R90.P$2
LIGHT_C_6: LIGHT_C_6.P$1 R91.P$2
LIGHT_C_7: LIGHT_C_7.P$1 R92.P$2
LIGHT_R_0: LIGHT_R_0.P$1 R76.P$2 U23.6(D7)
LIGHT_R_1: LIGHT_R_1.P$1 R75.P$2 U23.5(D6)
LIGHT_R_2: LIGHT_R_2.P$1 R74.P$2 U23.4(D5)
LIGHT_R_3: LIGHT_R_3.P$1 R73.P$2 U23.3(D4)
LIGHT_R_4: LIGHT_R_4.P$1 R72.P$2 U23.14(D3)
LIGHT_R_5: LIGHT_R_5.P$1 R71.P$2 U23.13(D2)
LIGHT_R_6: LIGHT_R_6.P$1 R70.P$2 U23.12(D1)
LIGHT_R_7: LIGHT_R_7.P$1 R69.P$2 U23.11(D0)
N$1: U18.10(SER) U19.9(QH)
N$2: U19.10(SER) U20.9(QH)
N$3: R7.P$2 U3.9(USBDM)
N$4: R8.P$2 U3.8(USBDP)
N$5: C7.P$1 R7.P$1 U4.4(I/O2B)
N$6: C8.P$1 R8.P$1 U4.3(I/O1B)
N$8: R10.P$1 USB_PWR.ANODE
N$9: R11.P$1 TX.ANODE
N$10: R12.P$1 RX.ANODE
N$11: R18.2 U10.4(GATE) U12.3(COLLECTOR)
N$12: R20.2 U11.4(GATE) U13.3(COLLECTOR)
N$13: R19.2 U12.1(BASE)
N$14: U20.10(SER) U21.9(QH)
N$15: R21.2 U13.1(BASE)
N$16: U21.10(SER) U22.9(QH)
N$17: U22.10(SER) U23.9(QH)
N$18: U23.10(SER) U24.9(QH)
N$21: U14.9(Q7S) U15.14(DS)
N$22: U16.10(SER) U17.9(QH)
N$23: U24.10(SER) U26.9(QH)
N$24: U17.10(SER) U18.9(QH)
N$25: U26.10(SER) U27.9(QH)
N$26: U27.10(SER) U28.9(QH)
N$27: U28.10(SER) U29.9(QH)
N$28: U29.10(SER) U30.9(QH)
N$29: R84.P$2 R92.P$1 U24.11(D0)
N$30: !MCLR!/VPP.P$1 PICKIT3_IN.1
N$31: PICKIT3_IN.2 VDD.P$1
N$32: EXT_PWR.ANODE R30.P$1
N$33: PICKIT3_IN.3 VSS.P$1
N$34: ICSPDAT.P$1 PICKIT3_IN.4
N$35: ICSPCLK.P$1 PICKIT3_IN.5
N$36: PGM.P$1 PICKIT3_IN.6
N$37: R83.P$2 R91.P$1 U24.12(D1)
N$38: R82.P$2 R90.P$1 U24.13(D2)
N$39: R81.P$2 R89.P$1 U24.14(D3)
N$40: R80.P$2 R88.P$1 U24.3(D4)
N$41: R79.P$2 R87.P$1 U24.4(D5)
N$42: R78.P$2 R86.P$1 U24.5(D6)
N$43: R77.P$2 R85.P$1 U24.6(D7)
OPTO_1: OPTO_1_.P$1 U26.11(D0)
OPTO_2: OPTO_2_.P$1 U26.12(D1)
OPTO_3: OPTO_3_.P$1 U26.13(D2)
OPTO_4: OPTO_4_.P$1 U26.14(D3)
OPTO_5: OPTO_5_.P$1 U26.3(D4)
OPTO_6: OPTO_6_.P$1 U26.4(D5)
OPTO_7: OPTO_7_.P$1 U26.5(D6)
P1: U1.42(P1)
P2: U1.43(P2)
P3: U1.44(P3)
P4: U1.1(P4)
P5: U1.2(P5)
P6: U1.3(P6)
P7: U1.4(P7)
P14: U1.15(P14)
P15: U1.16(P15)
P22: U1.25(P22)
P23: U1.26(P23)
P24: U1.31(P24)
P25: U1.32(P25)
P26: U1.33(P26)
P27: U1.34(P27)
PROP_!RST: C9.P$2 R5.P$1 U1.7(RES')
PROP_AUX0: PROP_AUX0.P$1 U28.13(D2)
PROP_AUX1: PROP_AUX1.P$1 U28.14(D3)
PWR_ON: R19.1 R21.1 U1.41(P0)
R_FLIP_OUT: R_FLIP_OUT.P$1 U14.7(Q7)
RGB_BOUT_L: R94.P$2 RGB_BOUT_L.P$1 U29.12(D1)
RGB_BOUT_R: R99.P$2 RGB_BOUT_R.P$1 U28.5(D6)
RGB_GOUT_L: R93.P$2 RGB_GOUT_L.P$1 U29.11(D0)
RGB_GOUT_R: R98.P$2 RGB_GOUT_R.P$1 U28.4(D5)
RGB_ROUT_L: R100.P$2 RGB_ROUT_L.P$1 U28.6(D7)
RGB_ROUT_R: R97.P$2 RGB_ROUT_R.P$1 U28.3(D4)
RX: U1.37(P30) U3.4(RXD)
RX_LED: RX.CATHODE U3.14(CBUS1)
RX_PIC32: RX_PIC32.P$1 U1.11(P10)
RX_PROP: RX_PROP.P$1 U1.14(P13)
S_L: S_L.P$1 U16.3(D4)
S_R: S_R.P$1 U16.4(D5)
SCL: R3.P$1 U1.35(P28) U2.6(SCL) U9.P$5(SCL)
SD_CS: SD_CS.P$1 U16.11(D0)
SD_DI: SD_DI.P$1 U16.12(D1)
SD_DO: SD_DO.P$1 U16.14(D3)
SD_SCLK: SD_SCLK.P$1 U16.13(D2)
SDA: R4.P$1 U1.36(P29) U2.5(SDA) U9.P$6(SDA)
SERVO_0: SERVO_0_.P$1 U27.11(D0)
SERVO_1: SERVO_1_.P$1 U27.12(D1)
SERVO_2: SERVO_2_.P$1 U27.13(D2)
SERVO_3: SERVO_3_.P$1 U27.14(D3)
SERVO_4: SERVO_4_.P$1 U27.3(D4)
SHIELD: J1.S3(SLD) J1.S4(SLD) J1.S5(SLD) J1.S6(SLD) L1.P$1
SOL_PWR_0: R60.P$2 SOL_PWR_0.P$1 U21.6(D7)
SOL_PWR_1: R59.P$2 SOL_PWR_1.P$1 U21.5(D6)
SOL_PWR_2: R58.P$2 SOL_PWR_2.P$1 U21.4(D5)
SOL_PWR_3: R57.P$2 SOL_PWR_3.P$1 U21.3(D4)
SOL_PWR_4: R56.P$2 SOL_PWR_4.P$1 U21.14(D3)
SOL_PWR_5: R55.P$2 SOL_PWR_5.P$1 U21.13(D2)
SOL_PWR_6: R54.P$2 SOL_PWR_6.P$1 U21.12(D1)
SOL_PWR_7: R53.P$2 SOL_PWR_7.P$1 U21.11(D0)
SOL_PWR_8: R52.P$2 SOL_PWR_8.P$1 U20.6(D7)
SOL_PWR_9: R51.P$2 SOL_PWR_9.P$1 U20.5(D6)
SOL_PWR_10: R50.P$2 SOL_PWR_10.P$1 U20.4(D5)
SOL_PWR_11: R49.P$2 SOL_PWR_11.P$1 U20.3(D4)
SOL_PWR_12: R48.P$2 SOL_PWR_12.P$1 U20.14(D3)
SOL_PWR_13: R47.P$2 SOL_PWR_13.P$1 U20.13(D2)
SOL_PWR_14: R46.P$2 SOL_PWR_14.P$1 U20.12(D1)
SOL_PWR_15: R45.P$2 SOL_PWR_15.P$1 U20.11(D0)
SOL_PWR_16: R44.P$2 SOL_PWR_16.P$1 U19.6(D7)
SOL_PWR_17: R43.P$2 SOL_PWR_17.P$1 U19.5(D6)
SOL_PWR_18: R42.P$2 SOL_PWR_18.P$1 U19.4(D5)
SOL_PWR_19: R41.P$2 SOL_PWR_19.P$1 U19.3(D4)
SOL_PWR_20: R40.P$2 SOL_PWR_20.P$1 U19.14(D3)
SOL_PWR_21: R39.P$2 SOL_PWR_21.P$1 U19.13(D2)
SOL_PWR_22: R38.P$2 SOL_PWR_22.P$1 U19.12(D1)
SOL_PWR_23: R37.P$2 SOL_PWR_23.P$1 U19.11(D0)
ST_BU_OUT: ST_BU_OUT.P$1
ST_LI: ST_LI_.P$1 U16.5(D6)
SW_C_0: R61.P$2 SW_C_0.P$1 U22.11(D0)
SW_C_1: R62.P$2 SW_C_1.P$1 U22.12(D1)
SW_C_2: R63.P$2 SW_C_2.P$1 U22.13(D2)
SW_C_3: R64.P$2 SW_C_3.P$1 U22.14(D3)
SW_C_4: R65.P$2 SW_C_4.P$1 U22.3(D4)
SW_C_5: R66.P$2 SW_C_5.P$1 U22.4(D5)
SW_C_6: R67.P$2 SW_C_6.P$1 U22.5(D6)
SW_C_7: R68.P$2 SW_C_7.P$1 U22.6(D7)
SW_R_0: SW_R_0.P$1 U15.7(Q7)
SW_R_1: SW_R_1.P$1 U15.6(Q6)
SW_R_2: SW_R_2.P$1 U15.5(Q5)
SW_R_3: SW_R_3.P$1 U15.4(Q4)
SW_R_4: SW_R_4.P$1 U15.3(Q3)
SW_R_5: SW_R_5.P$1 U15.2(Q2)
SW_R_6: SW_R_6.P$1 U15.1(Q1)
SW_R_7: SW_R_7.P$1 U15.15(Q0)
TILT_OUT: TILT_OUT.P$1 U14.1(Q1)
TX: U1.38(P31) U3.1(TXD)
TX_LED: TX.CATHODE U3.15(CBUS0)
TX_PIC32: TX_PIC32.P$1 U1.10(P9)
TX_PROP: TX_PROP.P$1 U1.13(P12)
USB_!RST: C9.P$1 U3.2(!RTS)
USER_0_OUT: U14.6(Q6) USER_0_OUT.P$1
V_USB_0: J1.1(5V) R10.P$2 R13.P$2 U4.5(VB)
VBUS_SENSE: R9.P$2 R13.P$1 U3.16(CBUS3)
VIN: C13.P$1 C15.P$1 C17.P$1 C19.P$1 J2.PIN R14.1 TVS1.P$1 U5.3(IN) U6.3(IN) U7.3(VIN+)
VIN_CUR: R14.2 R18.1 U7.4(VIN-) U10.5(DRAIN) U10.6(DRAIN) U10.7(DRAIN) U10.8(DRAIN)
X0: U1.29(X0) X1.P$1(X0)
X1: U1.28(X1) X1.P$3(X1)
Unconnected: J1.4(ID) U2.1(A0) U3.6(!CTS) U3.7(CBUS2) U9.P$4(A_3) U15.9(Q7S) U16.6(D7) U16.7(QH') U17.7(QH') U18.7(QH') U19.7(QH') U20.7(QH') U21.7(QH') U22.7(QH') U23.7(QH') U24.7(QH') U26.6(D7) U26.7(QH') U27.4(D5) U27.5(D6) U27.6(D7) U27.7(QH') U28.7(QH') U29.7(QH') U30.3(D4) U30.4(D5) U30.5(D6) U30.6(D7) U30.7(QH') U30.10(SER) U30.12(D1) U30.13(D2) U30.14(D3)

## Library data of the parts
3.3V 5V 12V 50V !MCLR!/VPP !RES!_PROP !RST!_PIC32 BACK_OUT COIN_OUT DMD_1 DMD_3 DMD_5 DMD_7 DMD_9 DMD_11 DMD_13 DOOR_OUT ENTER_OUT EXT_RGB_CLK EXT_RGB_DATA GI_R_0 GI_R_1-GI_R_15 GND ICSPCLK ICSPDAT L_FLIP_OUT LIGHT_C_0 LIGHT_C_1-LIGHT_C_7 LIGHT_R_0 LIGHT_R_1-LIGHT_R_7 OPTO_1_ OPTO_2_ OPTO_3_ OPTO_4_ OPTO_5_ OPTO_6_ OPTO_7_ PGM PROP_AUX0 PROP_AUX1 R_FLIP_OUT RGB_BOUT_L RGB_BOUT_R RGB_GOUT_L RGB_GOUT_R RGB_ROUT_L RGB_ROUT_R RX_PIC32 RX_PROP S_L S_R SD_CS SD_DI SD_DO SD_SCLK SERVO_0_ SERVO_1_ SERVO_2_ SERVO_3_ SERVO_4_ SOL_GND SOL_PWR_0 SOL_PWR_1-SOL_PWR_23 ST_BU_OUT ST_LI_ SW_C_0 SW_C_1-SW_C_7 SW_R_0 SW_R_1-SW_R_7 TILT_OUT TX_PIC32 TX_PROP USER_0_OUT VDD VSS = PP_Connectors:POGO_PIN
C1 C21-C24 = PP_Passives:CAPACITOR_NON_POLAR: Capacitor Non Polarized
C2-C11 C17-C20 C25-C39 = MF_Passives:CAPACITOR_NP: Library: MF_Passives Description: Device for Non-Polarized Capacitors. Manufacture part number (MFG#), Voltage, Temperature Coefficient, and Tolerance can be added via Attributes.; MFG#: N/A; TEMP_COF: N/A; TOLERANCE: N/A; VOLTAGE: N/A
C12 = MF_Passives:CAPACITOR_P: Library: MF_Passives Description: Device for Polarized Capacitors. Manufacture part number (MFG#), Voltage Rating, and Tolerance can be added via Attributes.; MFG#: N/A; TOLERANCE: N/A; VOLTAGE: N/A
C13-C16 = MF_Passives:CAPACITOR_P: Library: MF_Passives Description: Device for Polarized Capacitors. Manufacture part number (MFG#), Voltage Rating, and Tolerance can be added via Attributes.; MFG#: N/A; TOLERANCE: N/A; VOTLAGE: N/A
EXT_PWR RX TX USB_PWR = MF_LEDs:LED_SINGLE: Library: MF_LEDs Description: Device for Single LED Packages. Manufacture part number (MFG#) can be added via Attributes.
H1-H21 = PP_Connectors:MOUNT_HOLE
J1 = MF_Connectors:USB: Library: MF_Connectors Description: 5 Pin USB Connectors. SLD is the shield connection. Usually tied to ground through a small ferrite bead.
J2 = MF_Connectors:DC_PWR_JACK: Library: MF_Connectors Description: DC Barrel Power Jack Connector.
L1 = MF_Passives:INDUCTOR: Library: MF_Passives Description: Device for Inductors. Manufacture part number (MFG#) can be added via Attributes.; MFG#: N/A
PICKIT3_IN = PP_Connectors:CON_01X06: 6 pin connectors; LABEL01: !MCLR!/VPP; LABEL02: VDD; LABEL03: VSS; LABEL04: ICSPDAT; LABEL05: ICSPCLK; LABEL06: PGM
R1-R5 R7-R13 R22-R94 R97-R100 = MF_Passives:RESISTOR: Library: MF_Passives Description: Device for Resistors. Manufacture part number (MFG#), Voltage, Tolerance, and Wattage Rating can be added via Attributes.; MFG#: N/A; TOLERANCE: N/A; VOLTAGE: N/A; WATTAGE: N/A
R14-R21 = PP_Passives:RESISTOR: Resistors
TVS1 = PP_Passives:TVS_DIODE
U1 = MF_IC_Digital:P8X32A: Manufacturer Part #: P8X32A Manufacturer: Parallax Description: 32-bit Microcontrollers - MCU LQFP pkg Propeller Chip
U2 = PP_DigitalIC:EEPROM_I2C
U3 = MF_IC_Digital:FT230X: Manufacturer Part #: FT230X Manufacturer: FTDI Description: USB Interface IC USB to Basic Serial UART IC
U4 = PP_Passives:IP4234CZ6: Mouser Part #: 771-IP4234CZ6125 Manufacturer Part #: IP4234CZ6,125 Manufacturer: NXP Semiconductors Description: ESD Suppressors Single USB 2.0 ESD Protection 6-Pin http://www.mouser.com/ProductDetail/NXP-Semiconductors/IP4234CZ6125/?qs=sGAEpiMZZMvxHShE6Whpu7QUdHOfUl1T0xbl582qhFk%3d
U5 U6 = PP_PowerIC:LINEAR_VOTLAGE_REGULATORS
U7 U8 = PP_AnalogIC:INA169: Manufacturer Part #: INA169NA/250 Manufacturer: Texas Instruments Description: Current & Power Monitors & Regulators Hi-Sd Msmnt Current Shunt Mntr Crnt Otp
U9 = PP_AnalogIC:MAX11613: Manufacturer Part #: MAX11613 Manufacturer: Maxim Integrated Description: Analog to Digital Converters - ADC 12-Bit 4Ch 94.4sps 3.6V Precision ADC
U10 U11 = PP_DiscreteSemi:MOSFET_P-CHANNEL_SINGLE
U12 U13 = PP_DiscreteSemi:BJT_NPN_SINGLE: BJT NPN - Single
U14 U15 = PP_DigitalIC:CD74HC595: Manufacturer Part #: CD74HC595 Manufacturer: Texas Instruments Description: Counter Shift Registers 8-Bit Shift Register
U16-U24 U26-U30 = PP_DigitalIC:CD74HC165: Manufacturer Part #: CD74HC165 Manufacturer: Texas Instruments Description: Counter Shift Registers High Speed CMOS 8-Bit Shift Register
X1 = MF_Frequency_Control:XTL: Library: MF_Frequency_Control Description: Device for Cyrstal Oscillators. Manufacture part number (MFG#) can be added via Attributes.

## Net classes
0 default: width 0.254 mm, drill 0.5 mm, clearance 0.152 mm